# EAGLE design BMS MiniCAN Themistor Board (EAGLE 7.7.0)
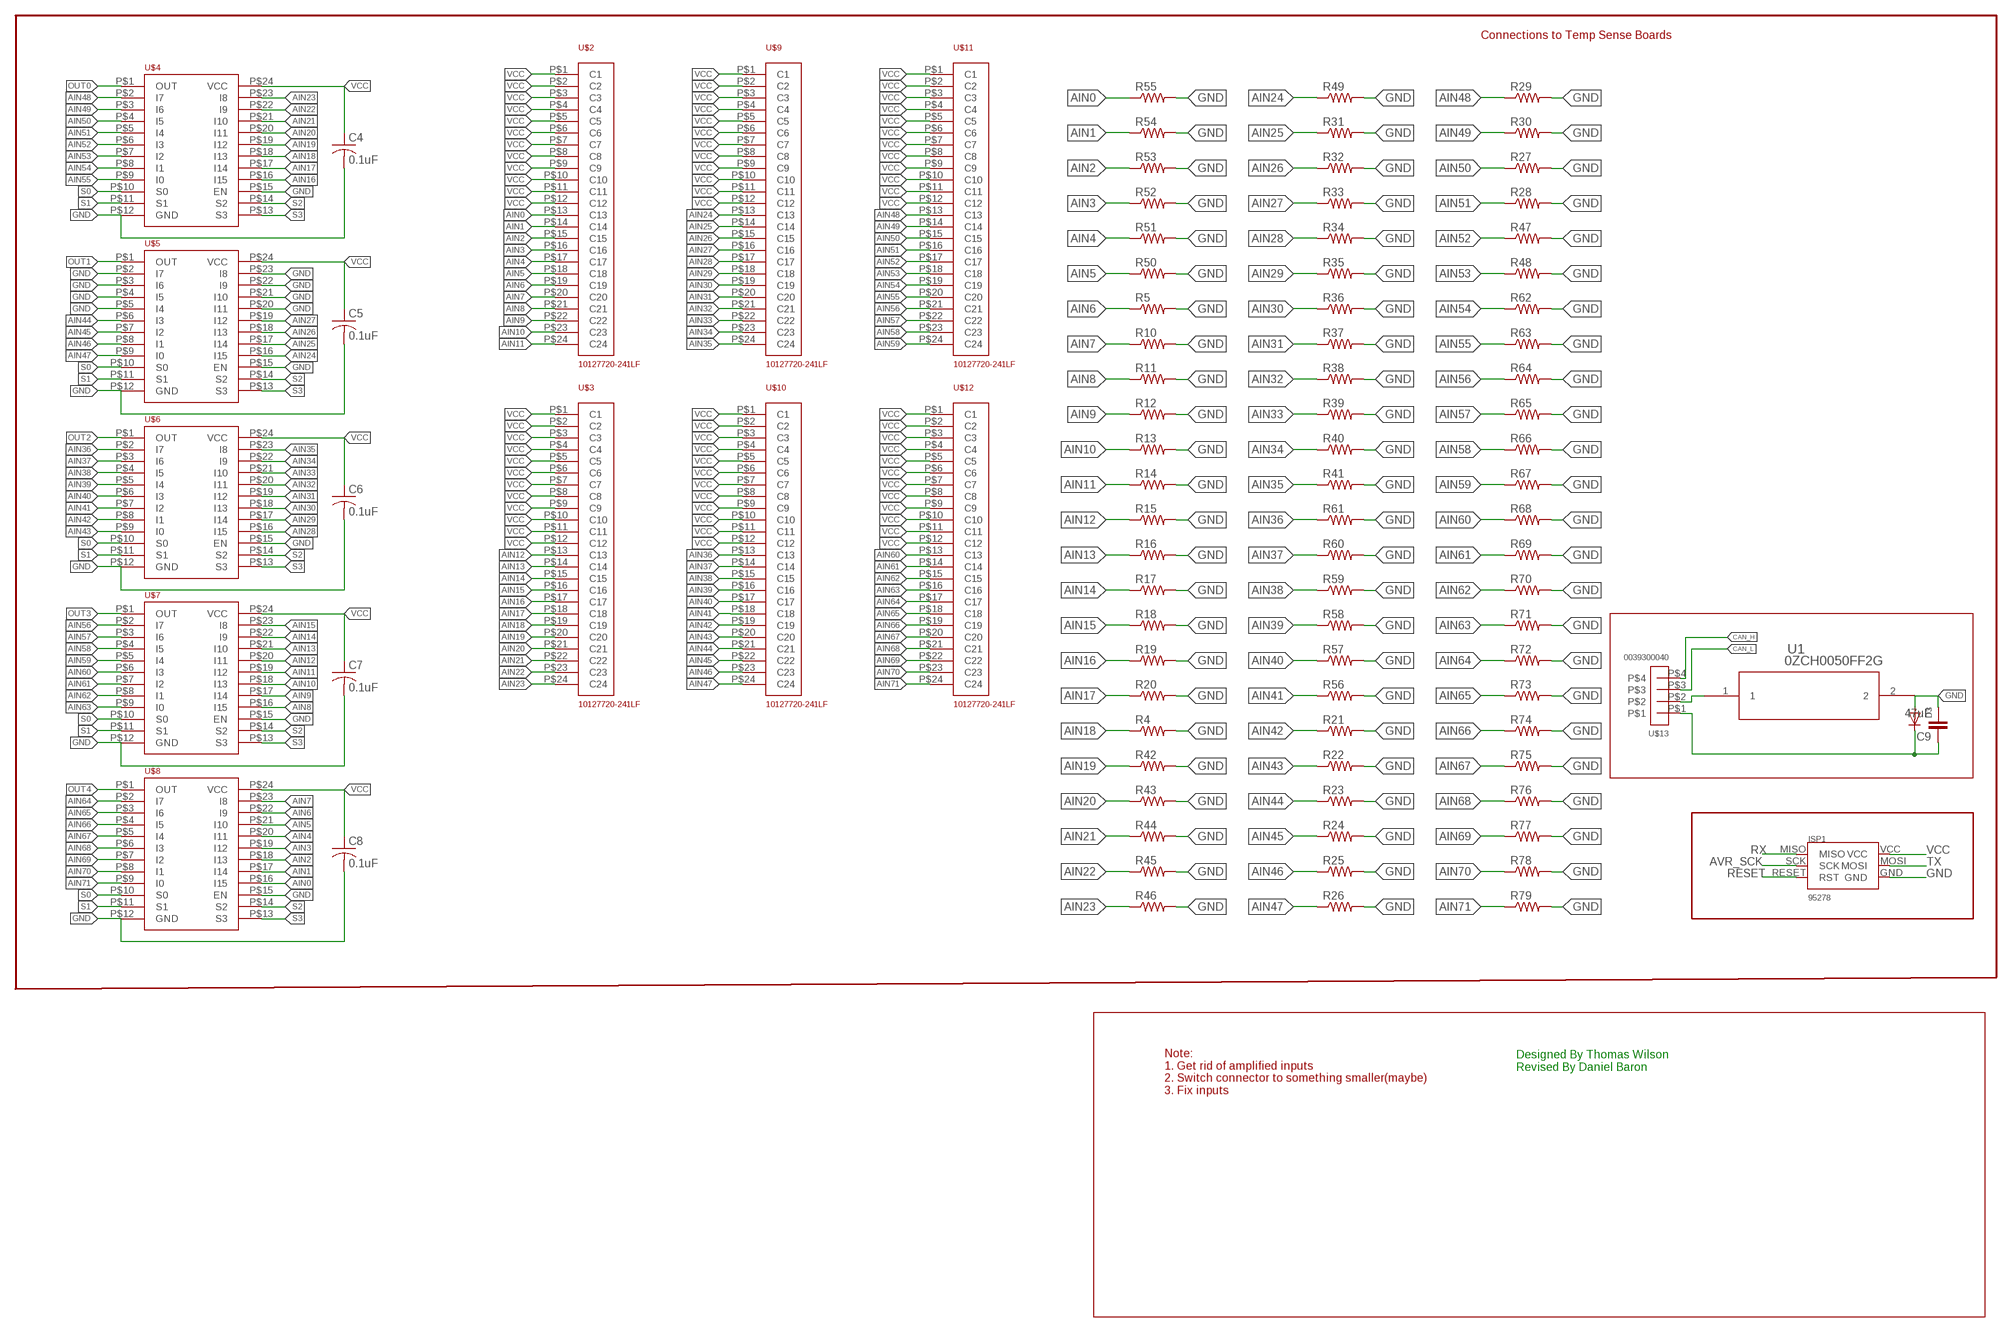
[diagram p0: schematic, sheet 1, part 1 of 2]
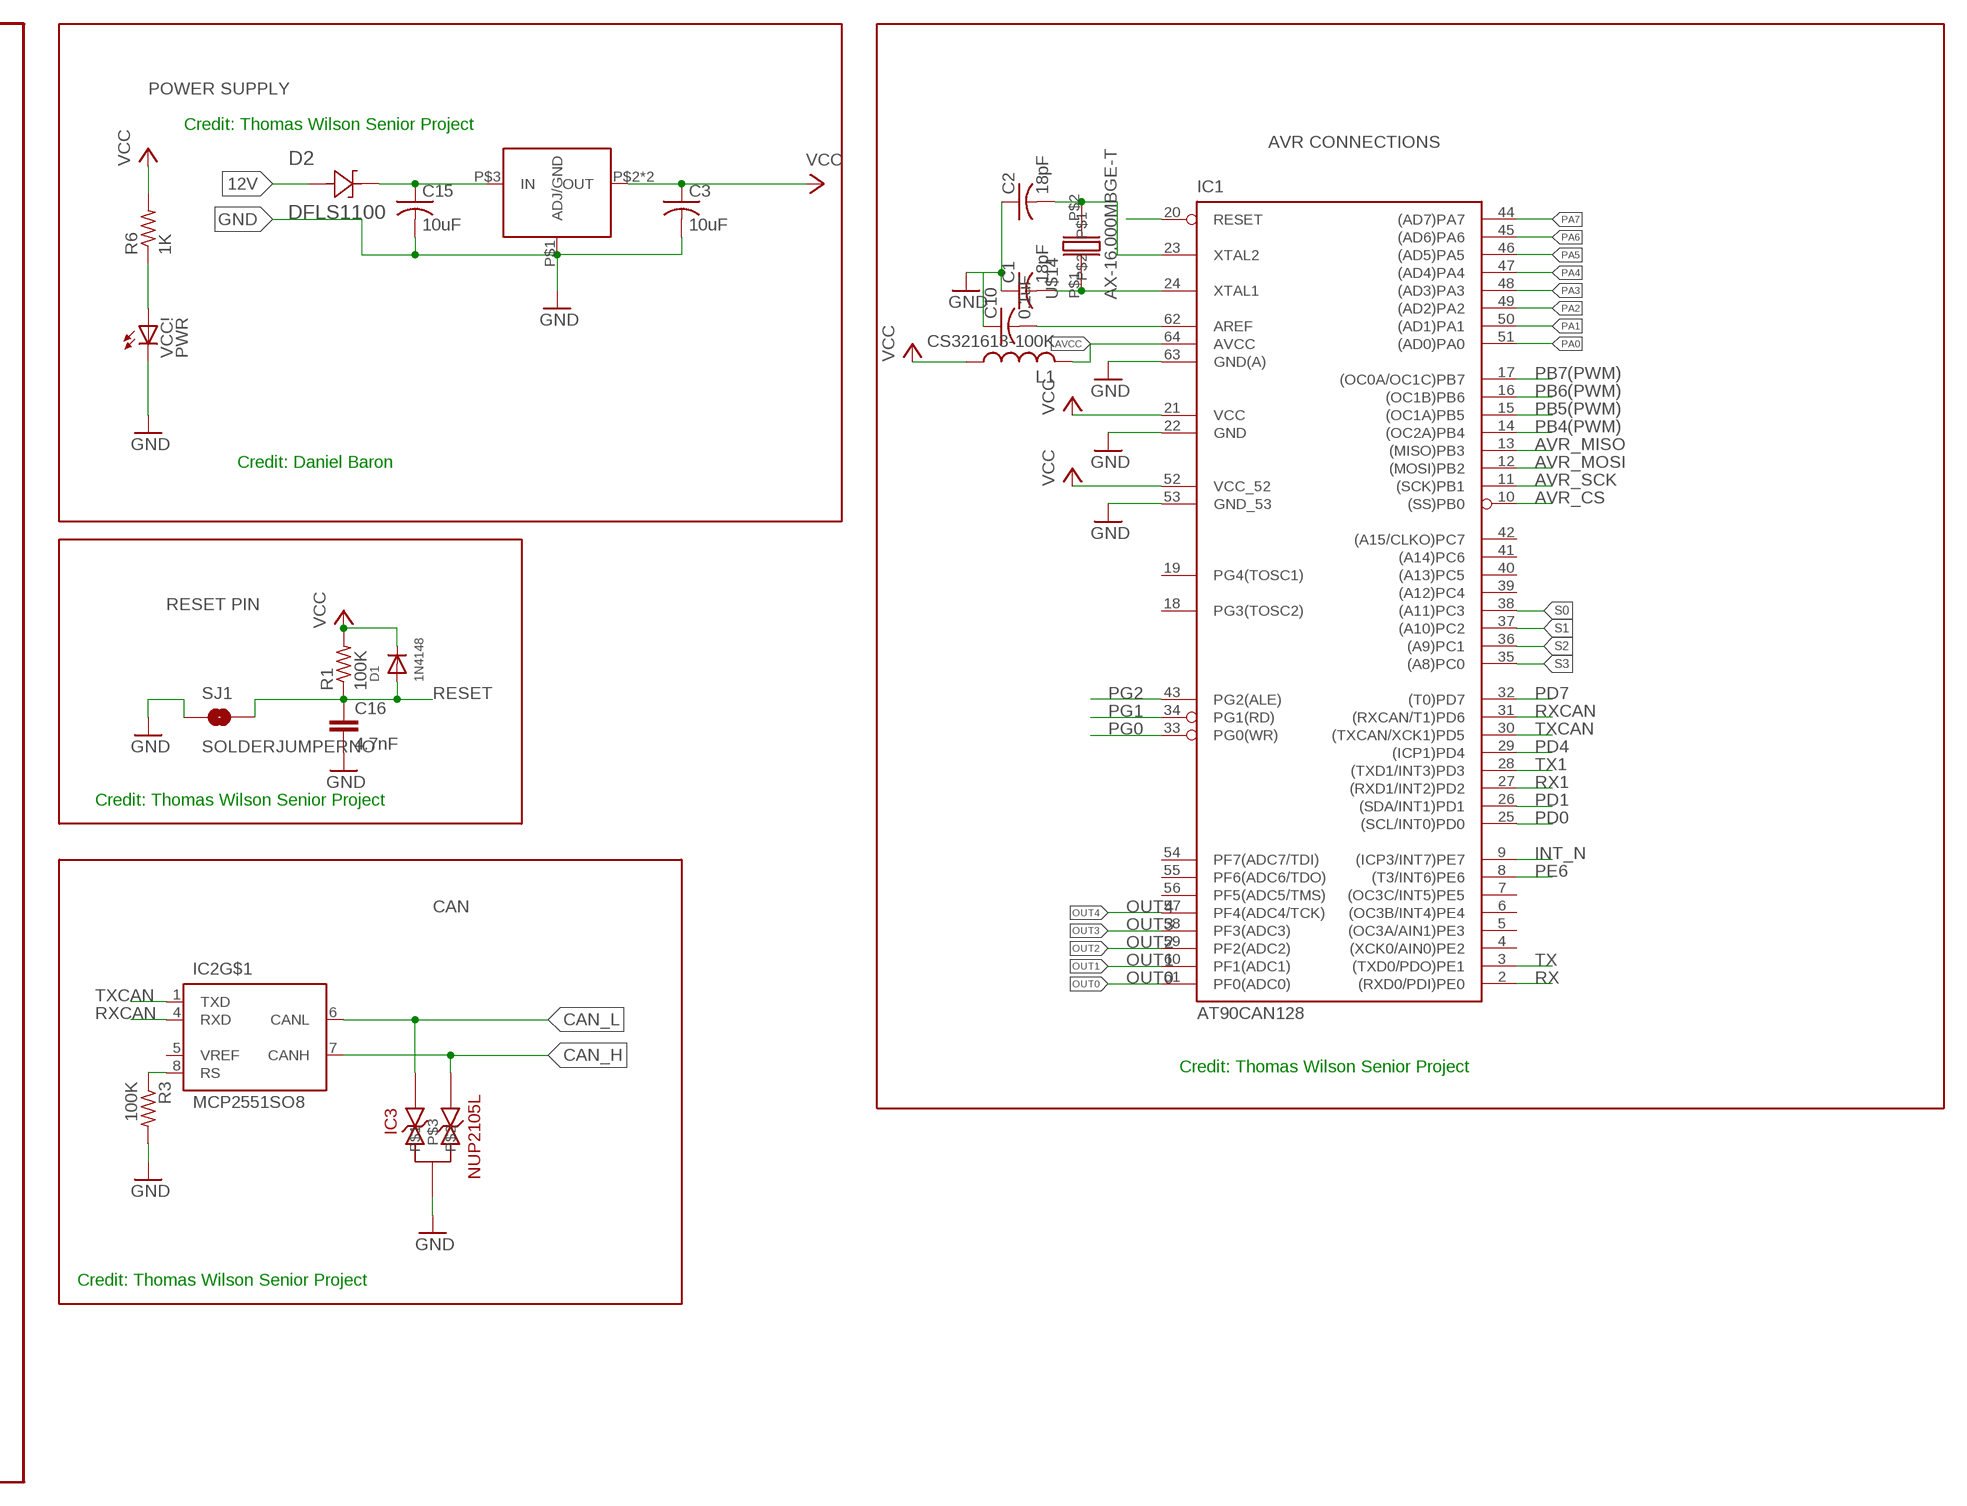
[diagram p1: schematic, sheet 1, part 2 of 2]

## Parts
C1  18pF  C-USC0805  [C0805]
C2  18pF  C-USC0805  [C0805]
C3  10uF  C-USC0805  [C0805]
C4  0.1uF  C-USC0805  [C0805]
C5  0.1uF  C-USC0805  [C0805]
C6  0.1uF  C-USC0805  [C0805]
C7  0.1uF  C-USC0805  [C0805]
C8  0.1uF  C-USC0805  [C0805]
C9  47uF  C-EUC0805  [C0805]
C10  0.1uF  C-USC0805  [C0805]
C15  10uF  C-USC0805  [C0805]
C16  4.7nF  CAP0603-CAP  [0603-CAP]
D1  1N4148  DIODESOD-123  [SOD-123]
D2  DFLS1100  [POWERDI-123]
D3  DIODESOD-323F  [SOD-323F]
IC1  AT90CAN128  [TQFP64]
IC2  MCP2551SO8  [SO08]
IC3  NUP2105L  [SOT-23]
ISP1  95278  [6_PIN_.1PITCH]
L1  CS321613-100K  L-USL3216C  [L3216C]
R1  100K  R-US_R0805  [R0805]
R3  100K  R-US_R0805  [R0805]
R4  R-US_R0603  [R0603]
R5  R-US_R0603  [R0603]
R6  1K  R-US_R0805  [R0805]
R10  R-US_R0603  [R0603]
R11  R-US_R0603  [R0603]
R12  R-US_R0603  [R0603]
R13  R-US_R0603  [R0603]
R14  R-US_R0603  [R0603]
R15  R-US_R0603  [R0603]
R16  R-US_R0603  [R0603]
R17  R-US_R0603  [R0603]
R18  R-US_R0603  [R0603]
R19  R-US_R0603  [R0603]
R20  R-US_R0603  [R0603]
R21  R-US_R0603  [R0603]
R22  R-US_R0603  [R0603]
R23  R-US_R0603  [R0603]
R24  R-US_R0603  [R0603]
R25  R-US_R0603  [R0603]
R26  R-US_R0603  [R0603]
R27  R-US_R0603  [R0603]
R28  R-US_R0603  [R0603]
R29  R-US_R0603  [R0603]
R30  R-US_R0603  [R0603]
R31  R-US_R0603  [R0603]
R32  R-US_R0603  [R0603]
R33  R-US_R0603  [R0603]
R34  R-US_R0603  [R0603]
R35  R-US_R0603  [R0603]
R36  R-US_R0603  [R0603]
R37  R-US_R0603  [R0603]
R38  R-US_R0603  [R0603]
R39  R-US_R0603  [R0603]
R40  R-US_R0603  [R0603]
R41  R-US_R0603  [R0603]
R42  R-US_R0603  [R0603]
R43  R-US_R0603  [R0603]
R44  R-US_R0603  [R0603]
R45  R-US_R0603  [R0603]
R46  R-US_R0603  [R0603]
R47  R-US_R0603  [R0603]
R48  R-US_R0603  [R0603]
R49  R-US_R0603  [R0603]
R50  R-US_R0603  [R0603]
R51  R-US_R0603  [R0603]
R52  R-US_R0603  [R0603]
R53  R-US_R0603  [R0603]
R54  R-US_R0603  [R0603]
R55  R-US_R0603  [R0603]
R56  R-US_R0603  [R0603]
R57  R-US_R0603  [R0603]
R58  R-US_R0603  [R0603]
R59  R-US_R0603  [R0603]
R60  R-US_R0603  [R0603]
R61  R-US_R0603  [R0603]
R62  R-US_R0603  [R0603]
R63  R-US_R0603  [R0603]
R64  R-US_R0603  [R0603]
R65  R-US_R0603  [R0603]
R66  R-US_R0603  [R0603]
R67  R-US_R0603  [R0603]
R68  R-US_R0603  [R0603]
R69  R-US_R0603  [R0603]
R70  R-US_R0603  [R0603]
R71  R-US_R0603  [R0603]
R72  R-US_R0603  [R0603]
R73  R-US_R0603  [R0603]
R74  R-US_R0603  [R0603]
R75  R-US_R0603  [R0603]
R76  R-US_R0603  [R0603]
R77  R-US_R0603  [R0603]
R78  R-US_R0603  [R0603]
R79  R-US_R0603  [R0603]
SJ1  SOLDERJUMPERNO  [SJ_2S-NO]
U1  0ZCH0050FF2G  [0ZCH]
U$1  LM117MPX-5.0  [SOT223-4]
U$2  10127720-241LF  [10127720-241LF]
U$3  10127720-241LF  [10127720-241LF]
U$4  CD74HC4067  [24-SOIC]
U$5  CD74HC4067  [24-SOIC]
U$6  CD74HC4067  [24-SOIC]
U$7  CD74HC4067  [24-SOIC]
U$8  CD74HC4067  [24-SOIC]
U$9  10127720-241LF  [10127720-241LF]
U$10  10127720-241LF  [10127720-241LF]
U$11  10127720-241LF  [10127720-241LF]
U$12  10127720-241LF  [10127720-241LF]
U$13  0039300040  [4_PIN_MOLEX]
U$14  AX-16.000MBGE-T  [2-SMD_NO_LEAD_(DFN_LCC)]
VCC!  PWR  LEDCHIPLED_0805  [CHIPLED_0805]

## Nets
12V: C9.1 D2.P$2 D3.C U$13.P$1
AIN0: R55.1 U$2.P$13(C13) U$8.P$16(I15)
AIN1: R54.1 U$2.P$14(C14) U$8.P$17(I14)
AIN2: R53.1 U$2.P$15(C15) U$8.P$18(I13)
AIN3: R52.1 U$2.P$16(C16) U$8.P$19(I12)
AIN4: R51.1 U$2.P$17(C17) U$8.P$20(I11)
AIN5: R50.1 U$2.P$18(C18) U$8.P$21(I10)
AIN6: R5.1 U$2.P$19(C19) U$8.P$22(I9)
AIN7: R10.1 U$2.P$20(C20) U$8.P$23(I8)
AIN8: R11.1 U$2.P$21(C21) U$7.P$16(I15)
AIN9: R12.1 U$2.P$22(C22) U$7.P$17(I14)
AIN10: R13.1 U$2.P$23(C23) U$7.P$18(I13)
AIN11: R14.1 U$2.P$24(C24) U$7.P$19(I12)
AIN12: R15.1 U$3.P$13(C13) U$7.P$20(I11)
AIN13: R16.1 U$3.P$14(C14) U$7.P$21(I10)
AIN14: R17.1 U$3.P$15(C15) U$7.P$22(I9)
AIN15: R18.1 U$3.P$16(C16) U$7.P$23(I8)
AIN16: R19.1 U$3.P$17(C17) U$4.P$16(I15)
AIN17: R20.1 U$3.P$18(C18) U$4.P$17(I14)
AIN18: R4.1 U$3.P$19(C19) U$4.P$18(I13)
AIN19: R42.1 U$3.P$20(C20) U$4.P$19(I12)
AIN20: R43.1 U$3.P$21(C21) U$4.P$20(I11)
AIN21: R44.1 U$3.P$22(C22) U$4.P$21(I10)
AIN22: R45.1 U$3.P$23(C23) U$4.P$22(I9)
AIN23: R46.1 U$3.P$24(C24) U$4.P$23(I8)
AIN24: R49.1 U$5.P$16(I15) U$9.P$13(C13)
AIN25: R31.1 U$5.P$17(I14) U$9.P$14(C14)
AIN26: R32.1 U$5.P$18(I13) U$9.P$15(C15)
AIN27: R33.1 U$5.P$19(I12) U$9.P$16(C16)
AIN28: R34.1 U$6.P$16(I15) U$9.P$17(C17)
AIN29: R35.1 U$6.P$17(I14) U$9.P$18(C18)
AIN30: R36.1 U$6.P$18(I13) U$9.P$19(C19)
AIN31: R37.1 U$6.P$19(I12) U$9.P$20(C20)
AIN32: R38.1 U$6.P$20(I11) U$9.P$21(C21)
AIN33: R39.1 U$6.P$21(I10) U$9.P$22(C22)
AIN34: R40.1 U$6.P$22(I9) U$9.P$23(C23)
AIN35: R41.1 U$6.P$23(I8) U$9.P$24(C24)
AIN36: R61.1 U$6.P$2(I7) U$10.P$13(C13)
AIN37: R60.1 U$6.P$3(I6) U$10.P$14(C14)
AIN38: R59.1 U$6.P$4(I5) U$10.P$15(C15)
AIN39: R58.1 U$6.P$5(I4) U$10.P$16(C16)
AIN40: R57.1 U$6.P$6(I3) U$10.P$17(C17)
AIN41: R56.1 U$6.P$7(I2) U$10.P$18(C18)
AIN42: R21.1 U$6.P$8(I1) U$10.P$19(C19)
AIN43: R22.1 U$6.P$9(I0) U$10.P$20(C20)
AIN44: R23.1 U$5.P$6(I3) U$10.P$21(C21)
AIN45: R24.1 U$5.P$7(I2) U$10.P$22(C22)
AIN46: R25.1 U$5.P$8(I1) U$10.P$23(C23)
AIN47: R26.1 U$5.P$9(I0) U$10.P$24(C24)
AIN48: R29.1 U$4.P$2(I7) U$11.P$13(C13)
AIN49: R30.1 U$4.P$3(I6) U$11.P$14(C14)
AIN50: R27.1 U$4.P$4(I5) U$11.P$15(C15)
AIN51: R28.1 U$4.P$5(I4) U$11.P$16(C16)
AIN52: R47.1 U$4.P$6(I3) U$11.P$17(C17)
AIN53: R48.1 U$4.P$7(I2) U$11.P$18(C18)
AIN54: R62.1 U$4.P$8(I1) U$11.P$19(C19)
AIN55: R63.1 U$4.P$9(I0) U$11.P$20(C20)
AIN56: R64.1 U$7.P$2(I7) U$11.P$21(C21)
AIN57: R65.1 U$7.P$3(I6) U$11.P$22(C22)
AIN58: R66.1 U$7.P$4(I5) U$11.P$23(C23)
AIN59: R67.1 U$7.P$5(I4) U$11.P$24(C24)
AIN60: R68.1 U$7.P$6(I3) U$12.P$13(C13)
AIN61: R69.1 U$7.P$7(I2) U$12.P$14(C14)
AIN62: R70.1 U$7.P$8(I1) U$12.P$15(C15)
AIN63: R71.1 U$7.P$9(I0) U$12.P$16(C16)
AIN64: R72.1 U$8.P$2(I7) U$12.P$17(C17)
AIN65: R73.1 U$8.P$3(I6) U$12.P$18(C18)
AIN66: R74.1 U$8.P$4(I5) U$12.P$19(C19)
AIN67: R75.1 U$8.P$5(I4) U$12.P$20(C20)
AIN68: R76.1 U$8.P$6(I3) U$12.P$21(C21)
AIN69: R77.1 U$8.P$7(I2) U$12.P$22(C22)
AIN70: R78.1 U$8.P$8(I1) U$12.P$23(C23)
AIN71: R79.1 U$8.P$9(I0) U$12.P$24(C24)
AREF: C10.2 IC1.62(AREF)
AVCC: IC1.64(AVCC) L1.2
AVR_CS: IC1.10((SS)PB0)
AVR_MISO: IC1.13((MISO)PB3)
AVR_MOSI: IC1.12((MOSI)PB2)
AVR_SCK: IC1.11((SCK)PB1) ISP1.SCK
CAN_H: IC2.7(CANH) IC3.2 U$13.P$4
CAN_L: IC2.6(CANL) IC3.1 U$13.P$3
GND: C1.1 C2.1 C3.2 C4.2 C5.2 C6.2 C7.2 C8.2 C9.2 C10.1 C15.2 C16.2 D3.A IC1.22(GND) IC1.53(GND_53) IC1.63(GND(A)) IC3.3 ISP1.GND R3.2 R4.2 R5.2 R10.2 R11.2 R12.2 R13.2 R14.2 R15.2 R16.2 R17.2 R18.2 R19.2 R20.2 R21.2 R22.2 R23.2 R24.2 R25.2 R26.2 R27.2 R28.2 R29.2 R30.2 R31.2 R32.2 R33.2 R34.2 R35.2 R36.2 R37.2 R38.2 R39.2 R40.2 R41.2 R42.2 R43.2 R44.2 R45.2 R46.2 R47.2 R48.2 R49.2 R50.2 R51.2 R52.2 R53.2 R54.2 R55.2 R56.2 R57.2 R58.2 R59.2 R60.2 R61.2 R62.2 R63.2 R64.2 R65.2 R66.2 R67.2 R68.2 R69.2 R70.2 R71.2 R72.2 R73.2 R74.2 R75.2 R76.2 R77.2 R78.2 R79.2 SJ1.1 U1.2 U$1.P$1(ADJ/GND) U$4.P$12(GND) U$4.P$15(EN) U$5.P$2(I7) U$5.P$3(I6) U$5.P$4(I5) U$5.P$5(I4) U$5.P$12(GND) U$5.P$15(EN) U$5.P$20(I11) U$5.P$21(I10) U$5.P$22(I9) U$5.P$23(I8) U$6.P$12(GND) U$6.P$15(EN) U$7.P$12(GND) U$7.P$15(EN) U$8.P$12(GND) U$8.P$15(EN) VCC!.C
INT_N: IC1.9((ICP3/INT7)PE7)
N$1: C15.1 D2.P$1 U$1.P$3(IN)
N$6: IC2.8(RS) R3.1
N$9: R6.1 VCC!.A
OUT0: IC1.61(PF0(ADC0)) U$4.P$1(OUT)
OUT1: IC1.60(PF1(ADC1)) U$5.P$1(OUT)
OUT2: IC1.59(PF2(ADC2)) U$6.P$1(OUT)
OUT3: IC1.58(PF3(ADC3)) U$7.P$1(OUT)
OUT4: IC1.57(PF4(ADC4/TCK)) U$8.P$1(OUT)
PA0: IC1.51((AD0)PA0)
PA1: IC1.50((AD1)PA1)
PA2: IC1.49((AD2)PA2)
PA3: IC1.48((AD3)PA3)
PA4: IC1.47((AD4)PA4)
PA5: IC1.46((AD5)PA5)
PA6: IC1.45((AD6)PA6)
PA7: IC1.44((AD7)PA7)
PB4(PWM): IC1.14((OC2A)PB4)
PB5(PWM): IC1.15((OC1A)PB5)
PB6(PWM): IC1.16((OC1B)PB6)
PB7(PWM): IC1.17((OC0A/OC1C)PB7)
PD0: IC1.25((SCL/INT0)PD0)
PD1: IC1.26((SDA/INT1)PD1)
PD4: IC1.29((ICP1)PD4)
PD7: IC1.32((T0)PD7)
PE6: IC1.8((T3/INT6)PE6)
PG0: IC1.33(PG0(WR))
PG1: IC1.34(PG1(RD))
PG2: IC1.43(PG2(ALE))
RESET: C16.1 D1.A IC1.20(RESET) ISP1.RESET(RST) R1.1 SJ1.2
RX: IC1.2((RXD0/PDI)PE0) ISP1.MISO
RX1: IC1.27((RXD1/INT2)PD2)
RXCAN: IC1.31((RXCAN/T1)PD6) IC2.4(RXD)
S0: IC1.38((A11)PC3) U$4.P$10(S0) U$5.P$10(S0) U$6.P$10(S0) U$7.P$10(S0) U$8.P$10(S0)
S1: IC1.37((A10)PC2) U$4.P$11(S1) U$5.P$11(S1) U$6.P$11(S1) U$7.P$11(S1) U$8.P$11(S1)
S2: IC1.36((A9)PC1) U$4.P$14(S2) U$5.P$14(S2) U$6.P$14(S2) U$7.P$14(S2) U$8.P$14(S2)
S3: IC1.35((A8)PC0) U$4.P$13(S3) U$5.P$13(S3) U$6.P$13(S3) U$7.P$13(S3) U$8.P$13(S3)
TX: IC1.3((TXD0/PDO)PE1) ISP1.MOSI
TX1: IC1.28((TXD1/INT3)PD3)
TXCAN: IC1.30((TXCAN/XCK1)PD5) IC2.1(TXD)
UF_GND: U1.1 U$13.P$2
VCC: C3.1 C4.1 C5.1 C6.1 C7.1 C8.1 D1.C IC1.21(VCC) IC1.52(VCC_52) ISP1.VCC L1.1 R1.2 R6.2 U$1.P$2(OUT) U$1.P$4(OUT) U$2.P$1(C1) U$2.P$2(C2) U$2.P$3(C3) U$2.P$4(C4) U$2.P$5(C5) U$2.P$6(C6) U$2.P$7(C7) U$2.P$8(C8) U$2.P$9(C9) U$2.P$10(C10) U$2.P$11(C11) U$2.P$12(C12) U$3.P$1(C1) U$3.P$2(C2) U$3.P$3(C3) U$3.P$4(C4) U$3.P$5(C5) U$3.P$6(C6) U$3.P$7(C7) U$3.P$8(C8) U$3.P$9(C9) U$3.P$10(C10) U$3.P$11(C11) U$3.P$12(C12) U$4.P$24(VCC) U$5.P$24(VCC) U$6.P$24(VCC) U$7.P$24(VCC) U$8.P$24(VCC) U$9.P$1(C1) U$9.P$2(C2) U$9.P$3(C3) U$9.P$4(C4) U$9.P$5(C5) U$9.P$6(C6) U$9.P$7(C7) U$9.P$8(C8) U$9.P$9(C9) U$9.P$10(C10) U$9.P$11(C11) U$9.P$12(C12) U$10.P$1(C1) U$10.P$2(C2) U$10.P$3(C3) U$10.P$4(C4) U$10.P$5(C5) U$10.P$6(C6) U$10.P$7(C7) U$10.P$8(C8) U$10.P$9(C9) U$10.P$10(C10) U$10.P$11(C11) U$10.P$12(C12) U$11.P$1(C1) U$11.P$2(C2) U$11.P$3(C3) U$11.P$4(C4) U$11.P$5(C5) U$11.P$6(C6) U$11.P$7(C7) U$11.P$8(C8) U$11.P$9(C9) U$11.P$10(C10) U$11.P$11(C11) U$11.P$12(C12) U$12.P$1(C1) U$12.P$2(C2) U$12.P$3(C3) U$12.P$4(C4) U$12.P$5(C5) U$12.P$6(C6) U$12.P$7(C7) U$12.P$8(C8) U$12.P$9(C9) U$12.P$10(C10) U$12.P$11(C11) U$12.P$12(C12)
XTAL1: C1.2 IC1.24(XTAL1) U$14.P$1
XTAL2: C2.2 IC1.23(XTAL2) U$14.P$2
Unconnected: IC1.4((XCK0/AIN0)PE2) IC1.5((OC3A/AIN1)PE3) IC1.6((OC3B/INT4)PE4) IC1.7((OC3C/INT5)PE5) IC1.18(PG3(TOSC2)) IC1.19(PG4(TOSC1)) IC1.39((A12)PC4) IC1.40((A13)PC5) IC1.41((A14)PC6) IC1.42((A15/CLKO)PC7) IC1.54(PF7(ADC7/TDI)) IC1.55(PF6(ADC6/TDO)) IC1.56(PF5(ADC5/TMS)) IC2.5(VREF)

## Notes on the sheet
- Connections to Temp Sense Boards
- POWER SUPPLY
- Credit: Thomas Wilson Senior Project
- AVR CONNECTIONS
- Credit: Daniel Baron
- RESET PIN
- Credit: Thomas Wilson Senior Project
- CAN
- Credit: Thomas Wilson Senior Project
- Credit: Thomas Wilson Senior Project
- Designed By Thomas Wilson
  Revised By Daniel Baron
- Note:
  1. Get rid of amplified inputs
  2. Switch connector to something smaller(maybe)
  3. Fix inputs

## Power pins joined to a net without a drawn wire
GND: IC2.2(GND)
VCC: IC2.3(VCC)

## Library data of the parts
C1 C2 C4-C8 C10 = rcl:C-US: CAPACITOR, American symbol
C3 C15 = resistor:C-US: CAPACITOR, American symbol
C9 = rcl:C-EU: CAPACITOR, European symbol
C16 = SparkFun-Capacitors:CAP: Capacitor Standard 0603 ceramic capacitor, and 0.1" leaded capacitor.
D1 D3 = adafruit:DIODE: Diode SMADIODE - SMA Surface Mount Package 20V 1A Schottky Diode Digikey: 641-1014-6-ND DO-1N4148 - Through Hole Small Current Diode SOD-123 20V 1 A (.5mV Vf) Schottky Diode - Digikey: MBRX120TPMSCT-ND SOD-323 10V 570mA (.38mV Vf, 3ns) Schottky Diode - Digikey: ZLLS410CT-ND SOD-523 30V 30mA Schottky Diode (RB751S-40TE61) - Digikey: RB751S-40TE61CT-ND SOT23-R/W - SOT23 Package (R = Solder Paste/Reflow Ovens, W = Hand-Soldering) BAT54Film 40V 300mA - Digikey: 497-7162-1-ND
D2 = BMS Lbr:DFLS1100: 1.0A HIGH VOLTAGE SCHOTTKY BARRIER RECTIFIER
IC1 = at90can128:AT90CAN128
IC2 = can:MCP2551: CAN Tranceiver Microchip
IC3 = Artificial Science:NUP2105L
ISP1 = con-amphenol:95278: SMD ISP Connector
L1 = rcl:L-US: INDUCTOR, American symbol
R1 R3 R6 = rcl:R-US_: RESISTOR, American symbol
R4 R5 R10-R79 = adafruit:R-US_: RESISTOR, American symbol
SJ1 = SparkFun-Passives:SOLDERJUMPER: Solder Jumper Standard SMD solder jumper. Used to automate production. Two varients : Normally Open and Normally Closed are the same, but have different paste layers. NC will have a large amount of paste and should jumper during reflow.
U1 = BMS Lbr:0ZCH0050FF2G; COPYRIGHT: Copyright (C) 2016 Accelerated Designs. All rights reserved; MANUFACTURER_PART_NUMBER: 0ZCH0050FF2G; VENDOR: Belfuse
U$1 = BMS Lbr:LM117MPX-5.0: 5V fixed voltage regulator, 1%
U$2 U$3 U$9-U$12 = con-amphenol:10127720-241LF: 24 Positions Plug Connector 0.118" (3.00mm) Through Hole, Right Angle Tin
U$4-U$8 = BMS Lbr:CD74HC4067: High-Speed CMOS Logic 16-Channel Analog Multiplexer/Demultiplexer
U$13 = BMS Lbr:0039300040: 4 Positions Header, Shrouded Connector 0.165" (4.20mm) Through Hole, Right Angle Tin
U$14 = BMS Lbr:AX-16.000MBGE-T: 16MHz ±50ppm Crystal 12pF 80 Ohm -40°C ~ 85°C AEC-Q200 Surface Mount 2-SMD, No Lead (DFN, LCC)
VCC! = led:LED: LED OSRAM: - CHIPLED LG R971, LG N971, LY N971, LG Q971, LY Q971, LO R971, LY R971 LH N974, LH R974 LS Q976, LO Q976, LY Q976 LO Q996 - Hyper CHIPLED LW Q18S LB Q993, LB Q99A, LB R99A - SideLED LS A670, LO A670, LY A670, LG A670, LP A670 LB A673, LV A673, LT A673, LW A673 LH A674 LY A675 LS A676, LA A676, LO A676, LY A676, LW A676 LS A679, LY A679, LG A679 - Hyper Micro SIDELED® LS Y876, LA Y876, LO Y876, LY Y876 LT Y87S - SmartLED LW L88C, LW L88S LB L89C, LB L89S, LG L890 LS L89K, LO L89K, LY L89K LS L896, LA L896, LO L896, LY L896 - TOPLED LS T670, LO T670, LY T670, LG T670, LP T670 LSG T670, LSP T670, LSY T670, LOP T670, LYG T670 LG T671, LOG T671, LSG T671 LB T673, LV T673, LT T673, LW T673 LH T674 LS T676, LA T676, LO T676, LY T676, LB T676, LH T676, LSB T676, LW T676 LB T67C, LV T67C, LT T67C, LS T67K, LO T67K, LY T67K, LW E67C LS E67B, LA E67B, LO E67B, LY E67B, LB E67C, LV E67C, LT E67C LW T67C LS T679, LY T679, LG T679 LS T770, LO T770, LY T770, LG T770, LP T770 LB T773, LV T773, LT T773, LW T773 LH T774 LS E675, LA E675, LY E675, LS T675 LS T776, LA T776, LO T776, LY T776, LB T776 LHGB T686 LT T68C, LB T68C - Hyper Mini TOPLED® LB M676 - Mini TOPLED Santana® LG M470 LS M47K, LO M47K, LY M47K Source: http://www.osram.convergy.de LUXEON: - LUMILED® LXK2-PW12-R00, LXK2-PW12-S00, LXK2-PW14-U00, LXK2-PW14-V00 LXK2-PM12-R00, LXK2-PM12-S00, LXK2-PM14-U00 LXK2-PE12-Q00, LXK2-PE12-R00, LXK2-PE12-S00, LXK2-PE14-T00, LXK2-PE14-U00 LXK2-PB12-K00, LXK2-PB12-L00, LXK2-PB12-M00, LXK2-PB14-N00, LXK2-PB14-P00, LXK2-PB14-Q00 LXK2-PR12-L00, LXK2-PR12-M00, LXK2-PR14-Q00, LXK2-PR14-R00 LXK2-PD12-Q00, LXK2-PD12-R00, LXK2-PD12-S00 LXK2-PH12-R00, LXK2-PH12-S00 LXK2-PL12-P00, LXK2-PL12-Q00, LXK2-PL12-R00 Source: www.luxeon.com KINGBRIGHT: KA-3528ASYC Source: www.kingbright.com

## Board
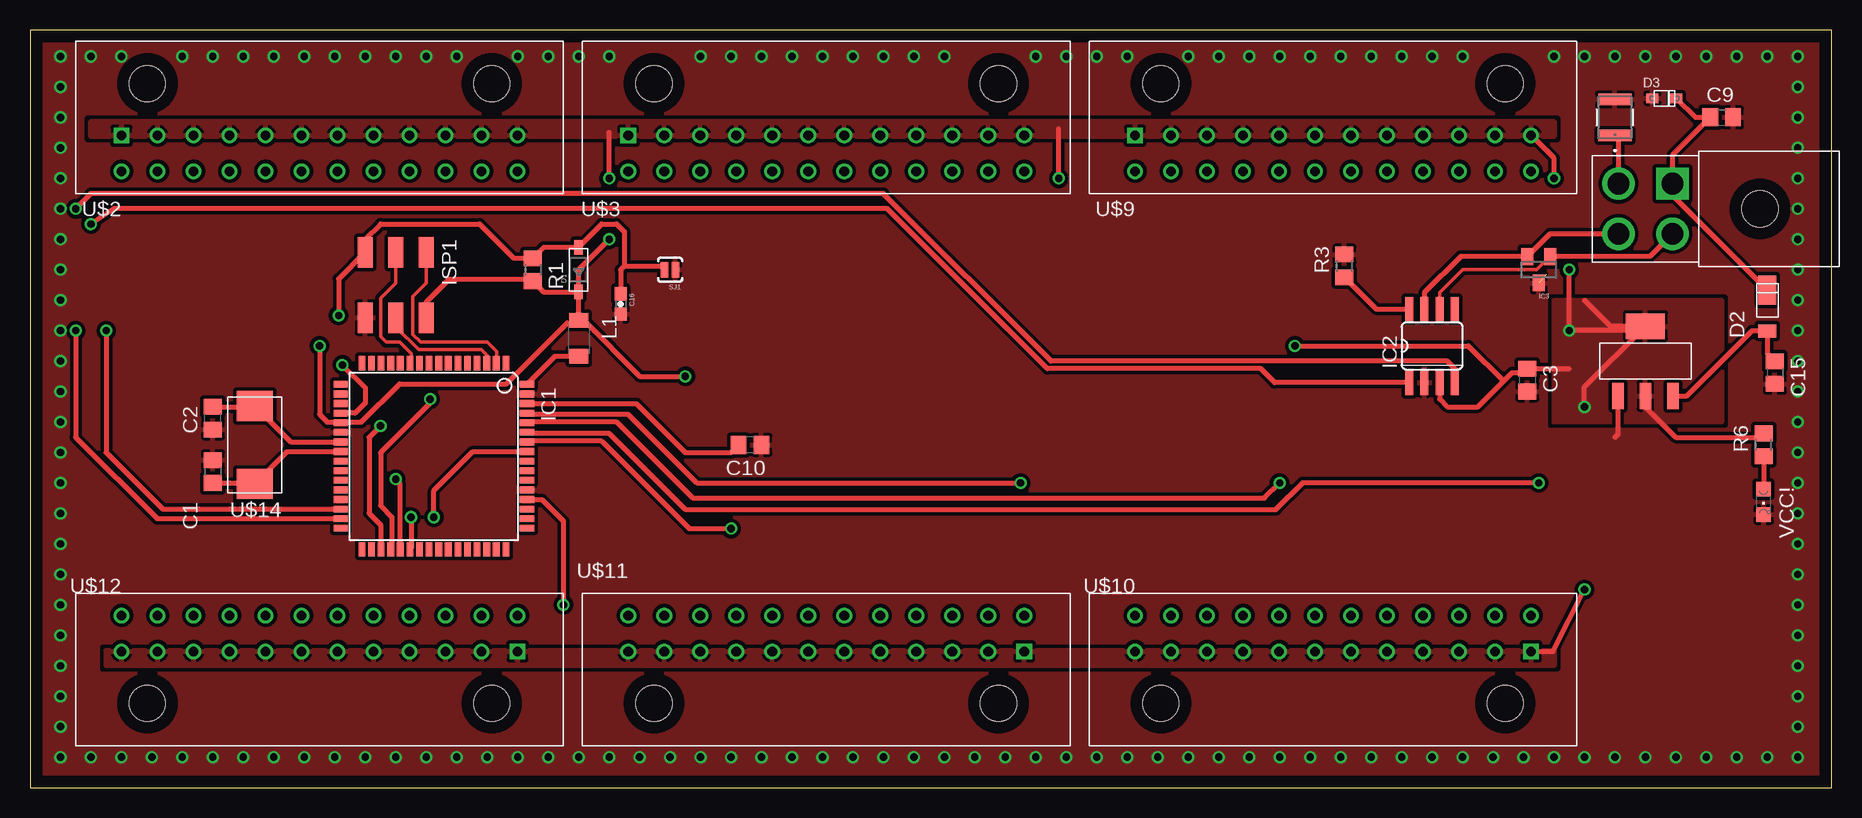
[diagram p2: board, top side]
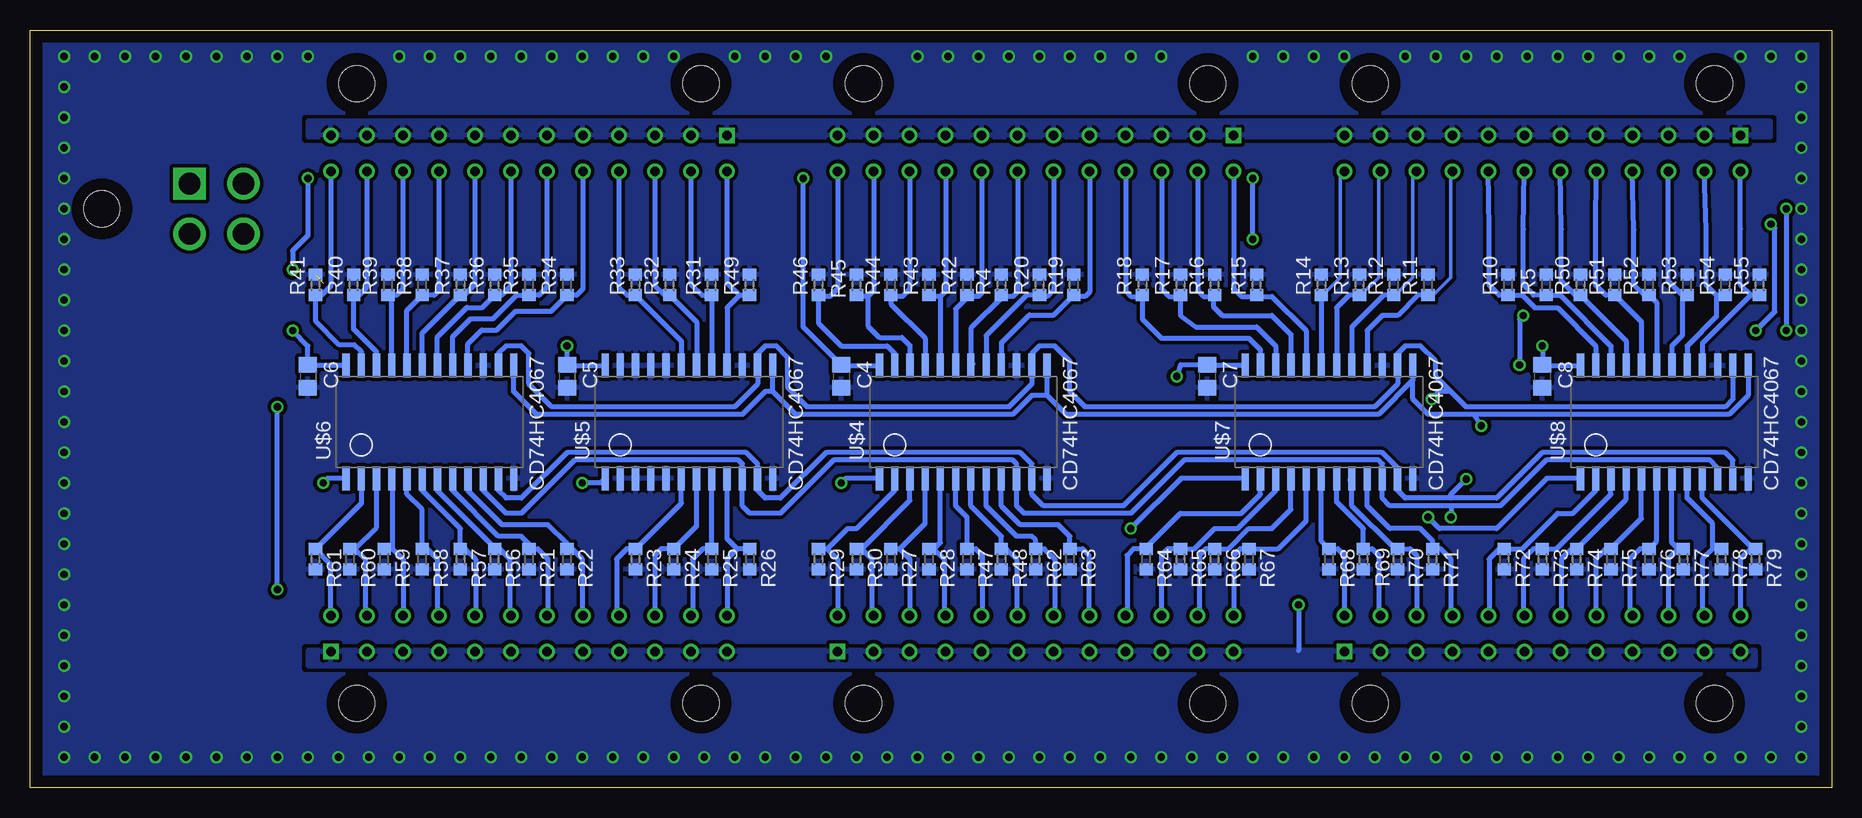
[diagram p3: board, bottom side, seen from below]

Size 150.16 x 63.17 mm. Coordinates in mm from the lower left corner, seen from the top.
Outline: 0,0 150.16,0 150.16,63.17 0,63.17 0,0
Copper layers (1*16): Top 0.035mm / dielectric 1.5mm / Bottom 0.035mm
Design rules "default": minimum track width 10mil, minimum drill 24mil, track to track 8mil, track to pad 8mil, pad to pad 8mil, via to via 8mil, smd to smd 8mil, copper to edge 40mil, drill to drill 8mil, minimum pad ring 10mil, minimum via ring 8mil, stop-mask expansion 4mil, vias tented up to drill 0mil, thermal gap 10mil

### Footprints (pad centres in the part's own frame; a part is rotated, then mirrored left to right if it is on the bottom)
C0805 = smd 1.3 x 1.5: 1 -0.95,0; 2 0.95,0
0603-CAP = smd 1.1 x 1: 1 -0.85,0; 2 0.85,0
SOD-123 = smd 1.2 x 0.7: A 1.85,0; C -1.85,0
POWERDI-123 = smd 1.05 x 1.5: P$1 -2.575,0 | smd 2.4 x 1.5: P$2 0.85,0
SOD-323F = smd 1 x 0.8: A -1,0; C 1,0
TQFP64 = smd 1.194 x 0.559: 1 -7.76,6; 2 -7.76,5.2; 3 -7.76,4.4; 4 -7.76,3.6; 5 -7.76,2.8; 6 -7.76,2; 7 -7.76,1.2; 8 -7.76,0.4; 9 -7.76,-0.4; 10 -7.76,-1.2; 11 -7.76,-2; 12 -7.76,-2.8; 13 -7.76,-3.6; 14 -7.76,-4.4; 15 -7.76,-5.2; 16 -7.76,-6; 33 7.76,-6; 34 7.76,-5.2; 35 7.76,-4.4; 36 7.76,-3.6; 37 7.76,-2.8; 38 7.76,-2; 39 7.76,-1.2; 40 7.76,-0.4; 41 7.76,0.4; 42 7.76,1.2; 43 7.76,2; 44 7.76,2.8; 45 7.76,3.6; 46 7.76,4.4; 47 7.76,5.2; 48 7.76,6 | smd 0.559 x 1.194: 17 -6,-7.76; 18 -5.2,-7.76; 19 -4.4,-7.76; 20 -3.6,-7.76; 21 -2.8,-7.76; 22 -2,-7.76; 23 -1.2,-7.76; 24 -0.4,-7.76; 25 0.4,-7.76; 26 1.2,-7.76; 27 2,-7.76; 28 2.8,-7.76; 29 3.6,-7.76; 30 4.4,-7.76; 31 5.2,-7.76; 32 6,-7.76; 49 6,7.76; 50 5.2,7.76; 51 4.4,7.76; 52 3.6,7.76; 53 2.8,7.76; 54 2,7.76; 55 1.2,7.76; 56 0.4,7.76; 57 -0.4,7.76; 58 -1.2,7.76; 59 -2,7.76; 60 -2.8,7.76; 61 -3.6,7.76; 62 -4.4,7.76; 63 -5.2,7.76; 64 -6,7.76
SO08 = smd 0.66 x 2.032: 1 -1.905,-3.073; 2 -0.635,-3.073; 3 0.635,-3.073; 4 1.905,-3.073; 5 1.905,3.073; 6 0.635,3.073; 7 -0.635,3.073; 8 -1.905,3.073
SOT-23 = smd 1 x 1.4: 1 -0.95,-1.1; 2 0.95,-1.1; 3 0,1.1
6_PIN_.1PITCH = smd 2.54 x 1.27: GND 2.73,-2.54; MISO -2.73,2.54; MOSI 2.73,0; RESET -2.73,-2.54; SCK -2.73,0; VCC 2.73,2.54
L3216C = smd 1.2 x 1.6: 1 -1.5,0; 2 1.5,0
R0805 = smd 1.3 x 1.5: 1 -0.95,0; 2 0.95,0
R0603 = smd 1 x 1.1: 1 -0.85,0; 2 0.85,0
SJ_2S-NO = smd 0.635 x 1.27: 1 -0.45,0; 2 0.45,0
0ZCH = smd 0.991 x 2.794: 1 -1.499,0; 2 1.499,0
SOT223-4 = smd 0.95 x 2.15: P$1 -2.3,-2.9; P$2 0,-2.9; P$3 2.3,-2.9 | smd 3.25 x 2.15: P$4 0,2.9
10127720-241LF = drill 0.8 pad 1.02 square: P$1 16.5,1.5 | drill 0.8 pad 1.02: P$2 13.5,1.5; P$3 10.5,1.5; P$4 7.5,1.5; P$5 4.5,1.5; P$6 1.5,1.5; P$7 -1.5,1.5; P$8 -4.5,1.5; P$9 -7.5,1.5; P$10 -10.5,1.5; P$11 -13.5,1.5; P$12 -16.5,1.5; P$13 16.5,4.5; P$14 13.5,4.5; P$15 10.5,4.5; P$16 7.5,4.5; P$17 4.5,4.5; P$18 1.5,4.5; P$19 -1.5,4.5; P$20 -4.5,4.5; P$21 -7.5,4.5; P$22 -10.5,4.5; P$23 -13.5,4.5; P$24 -16.5,4.5 | hole 3: -14.35,-2.82; 14.35,-2.82
24-SOIC = smd 0.6 x 2: P$1 -6.985,-4.7; P$2 -5.715,-4.7; P$3 -4.445,-4.7; P$4 -3.175,-4.7; P$5 -1.905,-4.7; P$6 -0.635,-4.7; P$7 0.635,-4.7; P$8 1.905,-4.7; P$9 3.175,-4.7; P$10 4.445,-4.7; P$11 5.715,-4.7; P$12 6.985,-4.7; P$13 6.985,4.7; P$14 5.715,4.7; P$15 4.445,4.7; P$16 3.175,4.7; P$17 1.905,4.7; P$18 0.635,4.7; P$19 -0.635,4.7; P$20 -1.905,4.7; P$21 -3.175,4.7; P$22 -4.445,4.7; P$23 -5.715,4.7; P$24 -6.985,4.7
4_PIN_MOLEX = drill 1.8 square: P$1 2.1,-2.25 | drill 1.8: P$2 2.1,2.25; P$3 -2.1,-2.25; P$4 -2.1,2.25 | hole 3: 0,-9.55
2-SMD_NO_LEAD_(DFN_LCC) = smd 2.5 x 3: P$1 -3.25,0; P$2 3.25,0
CHIPLED_0805 = smd 1.2 x 1.2: A 0,-1.05; C 0,1.05

### Placement (x,y rotation side)
C1  15.24,26.35 270 top
C2  15.24,30.8 90 top
C3  124.78,33.97 270 top
C4  82.55,34.29 270 bottom
C5  105.41,34.29 270 bottom
C6  127,34.29 270 bottom
C7  52.07,34.29 270 bottom
C8  24.13,34.29 270 bottom
C9  140.97,55.88 0 top
C10  60.01,28.57 180 top
C15  145.41,34.61 270 top
C16  49.21,40.32 270 top
D1  45.72,43.18 90 top
D2  144.78,40.64 90 top
D3  136.21,57.47 0 top
IC1  33.66,27.62 270 top
IC2  116.84,36.83 0 top
IC3  125.73,43.18 180 top
ISP1  30.48,41.91 270 top
L1  45.72,37.47 270 top
R1  41.91,43.18 270 top
R3  109.54,43.5 90 top
R4  69.22,41.91 90 bottom
R5  23.81,41.91 90 bottom
R6  144.46,28.57 90 top
R10  26.99,41.91 90 bottom
R11  33.66,41.91 90 bottom
R12  36.51,41.91 90 bottom
R13  39.37,41.91 90 bottom
R14  42.55,41.91 90 bottom
R15  47.94,41.91 90 bottom
R16  51.44,41.91 90 bottom
R17  54.29,41.91 90 bottom
R18  57.47,41.91 90 bottom
R19  63.18,41.91 90 bottom
R20  66.04,41.91 90 bottom
R21  108.58,19.05 270 bottom
R22  105.41,19.05 270 bottom
R23  99.69,19.05 270 bottom
R24  96.52,19.05 270 bottom
R25  93.34,19.05 270 bottom
R26  90.17,19.05 270 bottom
R27  78.42,19.05 270 bottom
R28  75.25,19.05 270 bottom
R29  84.45,19.05 270 bottom
R30  81.28,19.05 270 bottom
R31  93.38,41.91 90 bottom
R32  96.86,41.91 90 bottom
R33  99.72,41.91 90 bottom
R34  105.41,41.91 90 bottom
R35  108.58,41.91 90 bottom
R36  111.44,41.91 90 bottom
R37  114.3,41.91 90 bottom
R38  117.47,41.91 90 bottom
R39  120.33,41.91 90 bottom
R40  123.19,41.91 90 bottom
R41  126.36,41.91 90 bottom
R42  72.07,41.91 90 bottom
R43  75.25,41.91 90 bottom
R44  78.42,41.91 90 bottom
R45  81.28,41.91 90 bottom
R46  84.45,41.91 90 bottom
R47  72.07,19.05 270 bottom
R48  69.22,19.05 270 bottom
R49  90.2,41.91 90 bottom
R50  20.95,41.91 90 bottom
R51  18.1,41.91 90 bottom
R52  15.24,41.91 90 bottom
R53  12.06,41.91 90 bottom
R54  8.89,41.91 90 bottom
R55  6.03,41.91 90 bottom
R56  111.44,19.05 270 bottom
R57  114.3,19.05 270 bottom
R58  117.47,19.05 270 bottom
R59  120.65,19.05 270 bottom
R60  123.51,19.05 270 bottom
R61  126.36,19.05 270 bottom
R62  66.36,19.05 270 bottom
R63  63.5,19.05 270 bottom
R64  57.15,19.05 270 bottom
R65  54.29,19.05 270 bottom
R66  51.44,19.05 270 bottom
R67  48.58,19.05 270 bottom
R68  41.91,19.05 270 bottom
R69  39.05,19.05 270 bottom
R70  36.2,19.05 270 bottom
R71  33.27,19.05 270 bottom
R72  27.3,19.05 270 bottom
R73  24.13,19.05 270 bottom
R74  21.27,19.05 270 bottom
R75  18.41,19.05 270 bottom
R76  15.24,19.05 270 bottom
R77  12.38,19.05 270 bottom
R78  9.21,19.05 270 bottom
R79  6.35,19.05 270 bottom
SJ1  53.34,43.18 180 top
U1  132.08,55.88 90 top
U$1  134.62,35.56 0 top
U$2  24.13,55.88 180 top
U$3  66.36,55.88 180 top
U$4  72.39,30.48 0 bottom
U$5  95.25,30.48 0 bottom
U$6  116.84,30.48 0 bottom
U$7  41.91,30.48 0 bottom
U$8  13.97,30.48 0 bottom
U$9  108.58,55.88 180 top
U$10  108.58,9.84 0 top
U$11  66.36,9.84 0 top
U$12  24.13,9.84 0 top
U$13  134.62,48.26 90 top
U$14  18.73,28.57 90 top
VCC!  144.46,23.81 180 top

### Tracks (layer width: path | path; a pad name or v marks a point on that pad's centre or on a via)
12V
  Top 0.406: D2.P$2 136.87,49.4 U$13.P$1 136.87,52.73 C9.1 138.79,55.88 D3.C
AIN0
  Bottom 0.406: R55.1 6.77,41.06 | 6.77,41.06 7.62,41.91 7.62,46.61 U$2.P$13 | 6.77,41.06 10.79,37.04 U$8.P$16
AIN1
  Bottom 0.406: R54.1 9.63,41.06 | 9.63,41.06 10.48,41.91 10.48,46.47 U$2.P$14 | 9.63,41.06 9.63,39.27 12.06,36.83 U$8.P$17
AIN2
  Bottom 0.406: R53.1 12.48,41.06 | 12.48,41.06 13.65,42.23 13.65,46.6 U$2.P$15 | 12.48,41.06 12.48,37.68 13.34,36.83 U$8.P$18
AIN3
  Bottom 0.406: U$2.P$16 16.51,46.5 16.51,41.91 15.66,41.06 R52.1 14.61,40.43 U$8.P$19
AIN4
  Bottom 0.406: U$2.P$17 19.68,46.56 19.68,41.91 18.84,41.06 R51.1 15.88,38.84 U$8.P$20
AIN5
  Bottom 0.406: U$2.P$18 22.54,46.53 22.54,42.23 21.38,41.06 R50.1 17.14,37.25 U$8.P$21
AIN6
  Bottom 0.406: U$2.P$19 25.72,46.53 25.72,41.91 24.87,41.06 R5.1 22.64,41.06 18.41,36.83 U$8.P$22
AIN7
  Bottom 0.406: U$2.P$20 28.57,46.56 28.57,41.91 27.73,41.06 R10.1 25.82,41.06 24.77,40.01 22.86,40.01 19.68,36.83 U$8.P$23
AIN8
  Bottom 0.305: R11.1 33.23,41.06 31.75,42.55 31.75,51.26 U$2.P$21
  Bottom 0.406: R11.1 34.51,41.06 36.2,39.37 37.47,39.37 38.73,38.1 U$7.P$16
AIN9
  Bottom 0.305: R12.1 36.41,41.06 34.92,42.55 34.92,51.09 U$2.P$22
  Bottom 0.406: R12.1 37.36,41.06 40.01,38.42 U$7.P$17
AIN10
  Bottom 0.305: R13.1 39.27,41.06 37.78,42.55 37.78,51.23 U$2.P$23
  Bottom 0.406: R13.1 40.22,41.06 41.27,40.01 U$7.P$18
AIN11
  Bottom 0.305: R14.1 42.44,41.06 40.96,42.55 40.96,51.05 U$2.P$24
  Bottom 0.406: R14.1 U$7.P$19
AIN12
  Bottom 0.406: U$3.P$13 49.86,41.6 49.21,40.96 48.05,40.96 | 48.05,40.96 R15.1 | 48.05,40.96 46.67,40.96 43.81,38.1 U$7.P$20
AIN13
  Bottom 0.406: U$3.P$14 52.86,41.43 52.39,40.96 51.54,40.96 | 51.54,40.96 R16.1 | 51.54,40.96 51.54,40.11 50.8,39.37 46.67,39.37 45.09,37.78 U$7.P$21
AIN14
  Bottom 0.406: U$3.P$15 55.86,41.57 55.24,40.96 54.4,40.96 R17.1 54.29,39.37 53.02,38.42 47.94,38.42 46.35,36.83 U$7.P$22
AIN15
  Bottom 0.406: U$3.P$16 58.86,41.4 58.42,40.96 57.57,40.96 R18.1 57.47,39.05 55.88,37.47 48.58,37.47 47.62,36.51 U$7.P$23
AIN16
  Bottom 0.406: U$3.P$17 61.86,41.33 62.23,40.96 63.08,40.96 R19.1 64.83,39.42 66.88,39.42 69.22,37.08 U$4.P$16
AIN17
  Bottom 0.406: U$3.P$18 64.86,41.51 65.41,40.96 65.94,40.96 R20.1 67.11,41.06 70.48,37.68 U$4.P$17
AIN18
  Bottom 0.406: 71.6,35.34 U$4.P$18 71.75,38.32 69.11,40.96 | U$3.P$19 67.86,41.36 68.26,40.96 69.11,40.96 | 69.11,40.96 R4.1
AIN19
  Bottom 0.406: U$3.P$20 70.86,41.22 71.12,40.96 71.97,40.96 | 71.97,40.96 R42.1 | 71.97,40.96 73.03,39.9 U$4.P$19
AIN20
  Bottom 0.406: U$3.P$21 73.86,41.4 74.3,40.96 | 74.3,40.96 75.14,40.96 R43.1 | 74.3,40.96 U$4.P$20
AIN21
  Bottom 0.406: U$3.P$22 76.86,41.57 77.47,40.96 78.32,40.96 R44.1 78.42,40.32 75.56,37.47 U$4.P$21
AIN22
  Bottom 0.406: U$3.P$23 79.86,41.43 80.33,40.96 | 80.33,40.96 81.18,40.96 R45.1 | 80.33,40.96 80.33,38.49 79.38,37.54 77.5,37.54 76.83,36.88 U$4.P$22
AIN23
  Bottom 0.406: U$3.P$24 82.86,41.6 83.5,40.96 84.67,40.96 R46.1 84.45,38.74 82.55,36.83 78.74,36.83 78.11,36.2 U$4.P$23
AIN24
  Bottom 0.406: U$9.P$13 92.08,42.12 91.02,41.06 | 91.02,41.06 R49.1 | 91.02,41.06 92.08,40.01 U$5.P$16
AIN25
  Bottom 0.406: U$9.P$14 95.08,42 94.14,41.06 R31.1 93.34,41.03 U$5.P$17
AIN26
  Bottom 0.406: U$9.P$15 98.08,41.88 97.27,41.06 R32.1 94.61,38.82 U$5.P$18
AIN27
  Bottom 0.406: U$9.P$16 101.08,41.75 100.39,41.06 R33.1 95.89,37.23 U$5.P$19
AIN28
  Bottom 0.406: U$9.P$17 104.08,41.58 104.61,41.06 R34.1 106.74,39.73 109.69,39.73 111.25,38.17 112.5,38.17 113.67,37 U$6.P$16
AIN29
  Bottom 0.406: U$9.P$18 107.08,41.71 107.73,41.06 R35.1 109.61,41.06 111.56,39.1 113.44,39.1 114.94,37.61 U$6.P$17
AIN30
  Bottom 0.406: U$9.P$19 110.08,41.83 110.86,41.06 R36.1 112.46,40.04 113.75,40.04 116.2,37.59 U$6.P$18
AIN31
  Bottom 0.406: U$9.P$20 113.08,41.96 113.98,41.06 R37.1 117.47,37.89 U$6.P$19
AIN32
  Bottom 0.406: U$9.P$21 116.08,41.46 116.48,41.06 R38.1 118.75,39.79 U$6.P$20
AIN33
  Bottom 0.406: U$9.P$22 119.08,41.58 119.61,41.06 R39.1 120.02,40.74 U$6.P$21
AIN34
  Bottom 0.406: U$9.P$23 122.08,41.71 122.73,41.06 R40.1 123.19,38.23 121.28,36.33 U$6.P$22
AIN35
  Bottom 0.406: U$9.P$24 125.08,41.83 125.86,41.06 R41.1 126.36,38.91 124.38,36.92 123.12,36.92 122.56,36.35 U$6.P$23
AIN36
  Bottom 0.406: U$6.P$2 122.56,23.71 R61.1 125.08,18.62 U$10.P$13
AIN37
  Bottom 0.406: R60.1 123.09,19.9 | 123.09,19.9 122.24,19.05 122.24,14.49 U$10.P$14 | 123.09,19.9 121.28,21.7 U$6.P$3
AIN38
  Bottom 0.406: R59.1 119.91,19.9 | 119.91,19.9 119.06,19.05 119.06,14.37 U$10.P$15 | 119.91,19.9 119.91,25.68 U$6.P$4
AIN39
  Bottom 0.406: U$10.P$16 116.2,14.46 116.2,19.05 117.06,19.9 R58.1 117.47,23.18 118.75,24.45 U$6.P$5
AIN40
  Bottom 0.406: U$10.P$17 113.03,14.4 113.03,19.05 113.88,19.9 R57.1 114.3,21.59 117.47,24.77 U$6.P$6
AIN41
  Bottom 0.406: U$10.P$18 110.17,14.43 110.17,19.05 111.02,19.9 R56.1 111.44,20 116.2,24.77 U$6.P$7
AIN42
  Bottom 0.406: U$10.P$19 107,14.43 107,19.05 107.85,19.9 R21.1 108.58,20.32 109.22,20.95 111.12,20.95 114.94,24.77 U$6.P$8
AIN43
  Bottom 0.406: U$10.P$20 104.14,14.4 104.14,19.05 104.99,19.9 R22.1 105.41,20.32 107,21.91 110.81,21.91 113.67,24.77 U$6.P$9
AIN44
  Bottom 0.406: U$10.P$21 101.28,14.54 101.28,19.05 100.43,19.9 R23.1 95.89,23.71 U$5.P$6
AIN45
  Bottom 0.406: U$10.P$22 98.11,14.37 98.11,19.37 97.58,19.9 R24.1 94.61,21.8 U$5.P$7
AIN46
  Bottom 0.406: U$10.P$23 94.93,14.49 94.93,19.05 94.08,19.9 R25.1 U$5.P$8
AIN47
  Bottom 0.406: R26.1 91.22,19.9 | 91.22,19.9 92.08,19.05 92.08,14.35 U$10.P$24 | 91.22,19.9 92.08,20.75 U$5.P$9
AIN48
  Bottom 0.406: R29.1 83.72,19.9 | 83.72,19.9 82.87,19.05 82.87,14.35 U$11.P$13 | 83.72,19.9 82.03,21.59 81.28,21.59 78.11,24.77 U$4.P$2
AIN49
  Bottom 0.406: R30.1 80.86,19.9 | 80.86,19.9 80.01,19.05 80.01,14.49 U$11.P$14 | 80.86,19.9 76.83,23.93 U$4.P$3
AIN50
  Bottom 0.406: R27.1 77.69,19.9 | 77.69,19.9 76.83,19.05 76.83,14.37 U$11.P$15 | 77.69,19.9 75.56,22.02 U$4.P$4
AIN51
  Bottom 0.406: R28.1 74.83,19.9 | 74.83,19.9 73.98,19.05 73.98,14.46 U$11.P$16 | 74.83,19.9 74.3,20.43 U$4.P$5
AIN52
  Bottom 0.406: U$11.P$17 70.8,14.4 70.8,19.37 71.33,19.9 R47.1 72.07,22.54 73.03,23.5 U$4.P$6
AIN53
  Bottom 0.406: U$11.P$18 67.94,14.43 67.94,19.05 68.8,19.9 R48.1 69.22,20.95 71.75,23.5 U$4.P$7
AIN54
  Bottom 0.406: U$11.P$19 64.77,14.43 64.77,19.05 65.62,19.9 R62.1 66.36,20.64 66.67,20.95 67.94,20.95 70.48,23.5 U$4.P$8
AIN55
  Bottom 0.406: U$11.P$20 61.91,14.4 61.91,19.37 62.45,19.9 R63.1 63.5,20.95 64.45,21.91 67.63,21.91 69.22,23.5 U$4.P$9
AIN56
  Bottom 0.406: 57.25,19.9 58.2,19.9 58.74,19.37 58.74,14.46 U$11.P$21 | R64.1 57.25,19.9 | 57.25,19.9 54.29,22.86 49.21,22.86 47.62,24.45 U$7.P$2
AIN57
  Bottom 0.406: U$11.P$22 55.88,14.37 55.88,19.37 55.35,19.9 R65.1 53.12,19.9 51.44,21.59 49.53,21.59 46.35,24.77 U$7.P$3
AIN58
  Bottom 0.406: U$11.P$23 52.7,14.49 52.7,19.37 52.17,19.9 R66.1 50.27,19.9 48.58,21.59 46.67,21.59 45.09,23.18 U$7.P$4
AIN59
  Bottom 0.406: U$11.P$24 49.85,14.35 49.85,19.37 49.31,19.9 R67.1 46.14,19.9 43.81,22.22 U$7.P$5
AIN60
  Bottom 0.406: U$7.P$6 42.55,20.54 R68.1 41.17,19.9 40.64,19.37 40.64,14.35 U$12.P$13
AIN61
  Bottom 0.406: U$7.P$7 41.27,23.81 39.05,21.59 R69.1 38.31,19.9 37.78,19.37 37.78,14.49 U$12.P$14
AIN62
  Bottom 0.406: 40.16,25.62 U$7.P$8 40.01,23.5 36.41,19.9 R70.1 35.14,19.9 34.61,19.37 34.61,14.37 U$12.P$15
AIN63
  Bottom 0.406: U$7.P$9 38.73,23.5 36.83,21.59 34.29,21.59 33.27,20.57 R71.1 32.6,19.9 31.75,19.05 31.75,14.46 U$12.P$16
AIN64
  Bottom 0.406: U$12.P$17 28.57,14.4 28.57,19.05 27.73,19.9 R72.1 25.82,19.9 22.86,22.86 21.59,22.86 19.68,24.77 U$8.P$2
AIN65
  Bottom 0.406: U$12.P$18 25.72,14.43 25.72,19.05 24.87,19.9 R73.1 22.96,19.9 18.41,24.45 U$8.P$3
AIN66
  Bottom 0.406: 22.63,14.52 U$12.P$19 22.54,14.43 22.54,19.05 21.69,19.9 R74.1 17.14,24.03 U$8.P$4
AIN67
  Bottom 0.406: U$12.P$20 19.68,14.4 19.68,19.05 18.84,19.9 R75.1 15.88,22.44 U$8.P$5
AIN68
  Bottom 0.406: U$12.P$21 16.83,14.54 16.83,19.05 15.98,19.9 R76.1 14.61,20.54 U$8.P$6
AIN69
  Bottom 0.406: R77.1 12.8,19.9 | 12.8,19.9 13.65,19.05 13.65,14.37 U$12.P$22 | 12.8,19.9 13.34,20.43 U$8.P$7
AIN70
  Bottom 0.406: 10.48,14.49 U$12.P$23 10.79,14.51 10.79,19.05 9.95,19.9 | R78.1 9.95,19.9 | 9.95,19.9 9.95,22.01 12.06,24.13 U$8.P$8
AIN71
  Bottom 0.406: R79.1 6.77,19.9 | 6.77,19.9 7.62,19.05 7.62,14.35 U$12.P$24 | 6.77,19.9 6.77,20.11 10.79,24.13 U$8.P$9
AREF
  Top 0.406: IC1.62 50.53,32.02 54.61,27.94 58.42,27.94 C10.2
AVCC
  Top 0.406: IC1.64 43.76,35.97 L1.2
AVR_SCK
  Top 0.305: ISP1.SCK 30.48,42.07 29.21,40.8 29.21,37.62 29.69,37.15 30.8,37.15 31.75,36.2 31.75,35.48
  Top 0.406: 31.75,35.48 IC1.11
CAN_H
  Top 0.406: U$13.P$4 126.66,46.16 IC3.2 119.21,44.28 116.2,41.28 IC2.7
CAN_L
  Top 0.305: IC3.1 125.58,43.18 119.38,43.18 117.47,41.28 IC2.6
  Top 0.406: U$13.P$3 134.99,44.28 IC3.1
GND  (via drill 0.6)  (1 unrouted)
  Top 0.406: U$1.P$1 132.32,29.45 132.08,29.21
  other vias: 2.54,20.32 2.54,17.78 2.54,15.24 2.54,12.7 2.54,10.16 2.54,7.62 2.54,5.08 2.54,2.54 5.08,2.54 7.62,2.54 10.16,2.54 12.7,2.54 15.24,2.54 17.78,2.54 20.32,2.54 22.86,2.54 25.4,2.54 27.94,2.54 30.48,2.54 33.02,2.54 35.56,2.54 38.1,2.54 40.64,2.54 43.18,2.54 45.72,2.54 48.26,2.54 50.8,2.54 53.34,2.54 55.88,2.54 58.42,2.54 147.32,20.32 147.32,17.78 147.32,15.24 147.32,12.7 147.32,10.16 147.32,7.62 147.32,5.08 147.32,2.54 45.72,60.96 48.26,60.96 55.88,60.96 58.42,60.96 60.96,60.96 63.5,60.96 66.04,60.96 68.58,60.96 71.12,60.96 73.66,60.96 76.2,60.96 83.82,60.96 86.36,60.96 88.9,60.96 91.44,60.96 96.52,60.96 147.32,55.88 2.54,55.88 5.08,60.96 7.62,60.96 12.7,60.96 15.24,60.96 17.78,60.96 20.32,60.96 22.86,60.96 25.4,60.96 27.94,60.96 30.48,60.96 33.02,60.96 35.56,60.96 40.64,60.96 43.18,60.96 60.96,2.54 63.5,2.54 66.04,2.54 68.58,2.54 71.12,2.54 73.66,2.54 76.2,2.54 78.74,2.54 81.28,2.54 83.82,2.54 86.36,2.54 88.9,2.54 91.44,2.54 93.98,2.54 99.06,2.54 96.52,2.54 99.06,60.96 101.6,60.96 104.14,60.96 106.68,60.96 109.22,60.96 111.76,60.96 114.3,60.96 116.84,60.96 119.38,60.96 127,60.96 129.54,60.96 132.08,60.96 134.62,60.96 101.6,2.54 104.14,2.54 106.68,2.54 109.22,2.54 111.76,2.54 114.3,2.54 116.84,2.54 119.38,2.54 121.92,2.54 124.46,2.54 127,2.54 129.54,2.54 132.08,2.54 134.62,2.54 147.32,53.34 147.32,50.8 147.32,48.26 147.32,45.72 147.32,43.18 147.32,40.64 147.32,38.1 147.32,35.56 147.32,33.02 147.32,30.48 147.32,27.94 147.32,25.4 147.32,22.86 2.54,53.34 2.54,50.8 2.54,48.26 2.54,45.72 2.54,43.18 2.54,40.64 2.54,38.1 2.54,35.56 2.54,30.48 2.54,27.94 2.54,25.4 2.54,22.86 137.16,60.96 139.7,60.96 142.24,60.96 144.78,60.96 137.16,2.54 139.7,2.54 142.24,2.54 144.78,2.54 2.54,33.02 2.54,58.42 2.54,60.96 147.32,58.42 147.32,60.96
  pour Top (isolate 0.305, rank 6): 0,0 150.16,0 150.16,63.5 0,63.5
  pour Bottom (isolate 0.305, rank 6): 0,0 150.16,0 150.16,63.5 0,63.5
N$1
  Top 0.406: U$1.P$3 138.07,32.66 143.51,38.1 144.75,38.1 D2.P$1 144.78,36.19 C15.1
N$6
  Top 0.406: R3.1 112.18,39.9 IC2.8
N$9
  Top 0.406: R6.1 VCC!.A
OUT0  (via drill 0.6)
  Top 0.406: IC1.61 41.52,31.11 49.85,31.11 55.56,25.4 v82.55,25.4
  Bottom 0.406: U$4.P$1 82.17,25.78 v82.55,25.4
OUT1  (via drill 0.6)
  Top 0.406: IC1.60 41.47,30.48 48.9,30.48 55.24,24.13 102.87,24.13 v104.14,25.4
  Bottom 0.406: U$5.P$1 102.61,25.4 v104.14,25.4
OUT2  (via drill 0.6)
  Top 0.406: IC1.59 41.51,29.53 48.26,29.53 54.61,23.18 103.82,23.18 106.05,25.4 v125.73,25.4
  Bottom 0.406: U$6.P$1 125.35,25.78 v125.73,25.4
OUT3  (via drill 0.6)
  Top 0.406: IC1.58 41.48,28.89 47.62,28.89 54.93,21.59 v58.42,21.59
  Bottom 0.406: U$7.P$1 54.23,25.78 v58.42,21.59
OUT4  (via drill 0.6)
  Top 0.406: v33.66,22.54 33.66,24.77 36.91,28.02 IC1.57
  Bottom 0.406: U$8.P$1 23.75,25.78 27.94,21.59 32.7,21.59 v33.66,22.54
RESET  (via drill 0.6)
  Top 0.406: 49.53,43.5 49.53,46.36 48.9,46.99 47.62,46.99 45.72,45.09 D1.A 42.81,45.03 R1.1 40.32,44.13 37.47,46.99 29.21,46.99 27.94,45.72 ISP1.RESET 25.72,42.42 v25.72,39.37 | 49.53,43.5 49.21,43.18 C16.1 | 49.53,43.5 52.57,43.5 SJ1.2 | v26.04,35.24 27.94,33.34 27.94,32.07 27.09,31.22 IC1.20
  Bottom 0.406: v25.72,39.37 26.04,39.05 v26.04,35.24
RX
  Top 0.305: ISP1.MISO 33.02,42.07 31.91,40.96 31.91,37.78 32.54,37.15 38.1,37.15 38.89,36.35 38.89,35.42
  Top 0.406: 38.89,35.42 IC1.2
RXCAN  (via drill 0.6)
  Top 0.406: IC2.4 118.75,34.93 118.11,35.56 85.09,35.56 71.12,49.53 5.08,49.53 v3.81,48.26 | IC1.31 10.6,22.42 3.81,29.21 v3.81,38.1
  Bottom 0.406: v3.81,48.26 v3.81,38.1
S0  (via drill 0.6)
  Top 0.406: v31.75,22.54 31.75,19.96 IC1.38
  Bottom 0.406: U$6.P$10 112.39,24.77 110.49,22.86 109.22,22.86 104.78,27.3 91.12,27.3 90.81,26.99 U$5.P$10 90.81,23.5 90.17,22.86 87.63,22.86 83.19,27.3 68.26,27.3 67.94,26.99 U$4.P$10 67.94,23.5 67.31,22.86 58.42,22.86 53.98,27.3 37.78,27.3 37.47,26.99 U$7.P$10 37.47,24.13 36.83,23.5 31.73,23.5 | U$8.P$10 9.53,26.67 10.16,27.3 23.81,27.3 27.62,23.5 31.73,23.5 | 31.73,23.5 31.73,22.88 v31.75,22.54
S1  (via drill 0.6)
  Top 0.406: IC1.37 30.8,19.92 30.8,25.4 v30.48,25.72
  Bottom 0.406: 31.75,24.13 27.94,24.13 24.13,27.94 8.89,27.94 8.26,27.3 U$8.P$11 | 31.75,24.13 35.56,24.13 36.2,24.77 U$7.P$11 36.2,26.67 37.47,27.94 54.61,27.94 59.05,23.5 65.72,23.5 66.67,24.45 U$4.P$11 66.67,26.99 67.63,27.94 83.82,27.94 87.63,24.13 88.9,24.13 89.53,24.77 U$5.P$11 89.53,26.99 90.49,27.94 105.41,27.94 109.22,24.13 110.49,24.13 111.12,24.77 U$6.P$11 | 31.75,24.13 31.75,24.45 v30.48,25.72
S2  (via drill 0.6)
  Top 0.406: IC1.36 30.16,19.97 30.16,22.54 29.21,23.5 29.21,27.94 33.34,32.07 v33.34,32.38
  Bottom 0.406: U$8.P$14 8.26,32.38 8.89,31.75 30.48,31.75 31.75,33.02 | 31.75,33.02 33.02,34.29 33.02,35.56 34.29,36.83 35.56,36.83 36.2,36.2 U$7.P$14 36.2,33.66 38.1,31.75 62.23,31.75 63.5,33.02 63.5,35.56 64.77,36.83 66.04,36.83 66.67,36.2 U$4.P$14 66.67,33.66 68.58,31.75 85.41,31.75 87,33.34 87,35.88 87.95,36.83 88.9,36.83 89.53,36.2 U$5.P$14 89.53,33.66 91.44,31.75 106.68,31.75 108.58,33.66 108.58,36.2 109.22,36.83 110.49,36.83 111.12,36.2 U$6.P$14 | 31.75,33.02 32.7,33.02 v33.34,32.38
S3  (via drill 0.6)
  Top 0.406: IC1.35 29.21,19.91 29.21,21.91 28.26,22.86 28.26,29.21 v29.21,30.16
  Bottom 0.406: 65.41,32.7 U$4.P$13 | 65.41,32.7 66.67,32.7 68.26,31.11 86.36,31.11 88.27,33.02 | U$6.P$13 109.86,33.02 107.95,31.11 90.81,31.11 88.9,33.02 88.27,33.02 | 29.84,31.11 8.57,31.11 6.99,32.7 U$8.P$13 | 29.84,31.11 33.66,31.11 34.92,32.38 34.92,33.97 | 88.27,33.02 U$5.P$13 | 65.41,32.7 63.82,31.11 37.78,31.11 34.92,33.97 | U$7.P$13 34.92,33.97 | 29.84,31.11 v29.21,30.16
TX
  Top 0.305: 30.48,38.42 32.38,36.51 37.62,36.51 38.1,36.04 38.1,35.43
  Top 0.406: ISP1.MOSI 30.48,38.42 | 38.1,35.43 IC1.3
TXCAN  (via drill 0.6)
  Top 0.406: IC2.1 103.72,33.76 102.55,34.93 84.77,34.93 71.44,48.26 6.99,48.26 v5.08,46.99 | IC1.30 11.07,23.22 6.35,27.94 v6.35,38.1
  Bottom 0.406: v6.35,38.1 4.76,39.69 4.76,46.67 v5.08,46.99
UF_GND
  Top 0.406: U1.1 132.37,54.09 U$13.P$2
VCC  (via drill 0.6)
  Top 0.406: U$1.P$2 134.62,31.75 137.16,29.21 144.15,29.21 R6.2 | D1.C 42.81,41.33 R1.2 41.75,42.39 34.92,42.39 33.02,40.48 ISP1.VCC | U$1.P$4 134.26,38.1 v128.27,38.1 | v128.27,38.1 127.95,38.1 | U$1.P$4 131.72,38.46 129.54,40.64 | U$10.P$1 126.91,11.34 v129.54,16.51 | v129.54,31.75 129.54,33.38 U$1.P$4 | IC1.52 42.65,24.02 44.45,22.22 v44.45,15.24 | v85.72,50.8 85.72,54.93 | 128.27,34.93 C3.1 124.46,34.61 123.51,34.61 122.79,33.89 | IC2.3 117.47,32.38 118.11,31.75 120.65,31.75 122.79,33.89 | v128.27,38.1 v128.27,43.18 | D1.C 45.72,43.18 v48.26,45.72 | v48.26,50.8 48.26,54.61 | v105.41,36.83 119.86,36.83 122.79,33.89 | v127,50.8 127,52.47 U$9.P$12 | L1.1 D1.C | L1.1 46.12,38.97 50.8,34.29 v54.61,34.29 | v24.13,36.83 24.13,31.11 24.77,30.48 25.84,30.48 | 25.84,30.48 27.62,30.48 30.8,33.66 39.69,33.66 44.77,38.74 45.49,38.74 L1.1 | 25.84,30.48 IC1.21
  Bottom 0.406: U$7.P$24 48.95,35.24 C7.1 54.29,35.24 v54.61,34.29 | C8.1 24.07,35.18 | 24.07,35.18 U$8.P$24 | U$4.P$24 82.49,35.18 C4.1 85.72,38.42 v85.72,50.8 | U$5.P$24 105.35,35.18 C5.1 v105.41,36.83 | v129.54,16.51 v129.54,31.75 | v44.45,15.24 44.45,11.43 | U$6.P$24 126.94,35.18 C6.1 127,36.83 v128.27,38.1 | v127,50.8 127,46.04 128.27,44.77 v128.27,43.18 | v48.26,45.72 v48.26,50.8 | 24.07,35.18 24.07,36.77 v24.13,36.83
  pour Top (isolate 0.305): 127,40.64 140.97,40.64 140.97,30.48 127,30.48
  pour Bottom: 5.08,55.56 127,55.56 127,54.29 5.08,54.29
  pour Top: 5.08,55.56 127,55.56 127,54.29 5.08,54.29
  pour Top: 6.35,11.43 127,11.43 127,10.16 6.35,10.16
  pour Bottom: 6.35,11.43 127,11.43 127,10.16 6.35,10.16
XTAL1
  Top 0.406: C1.2 18.66,25.4 U$14.P$1 21.43,28.02 IC1.24
XTAL2
  Top 0.406: C2.2 18.66,31.75 U$14.P$2 21.73,28.82 IC1.23